# EAGLE schematic lightmeter_7 (EAGLE 9.6.2)
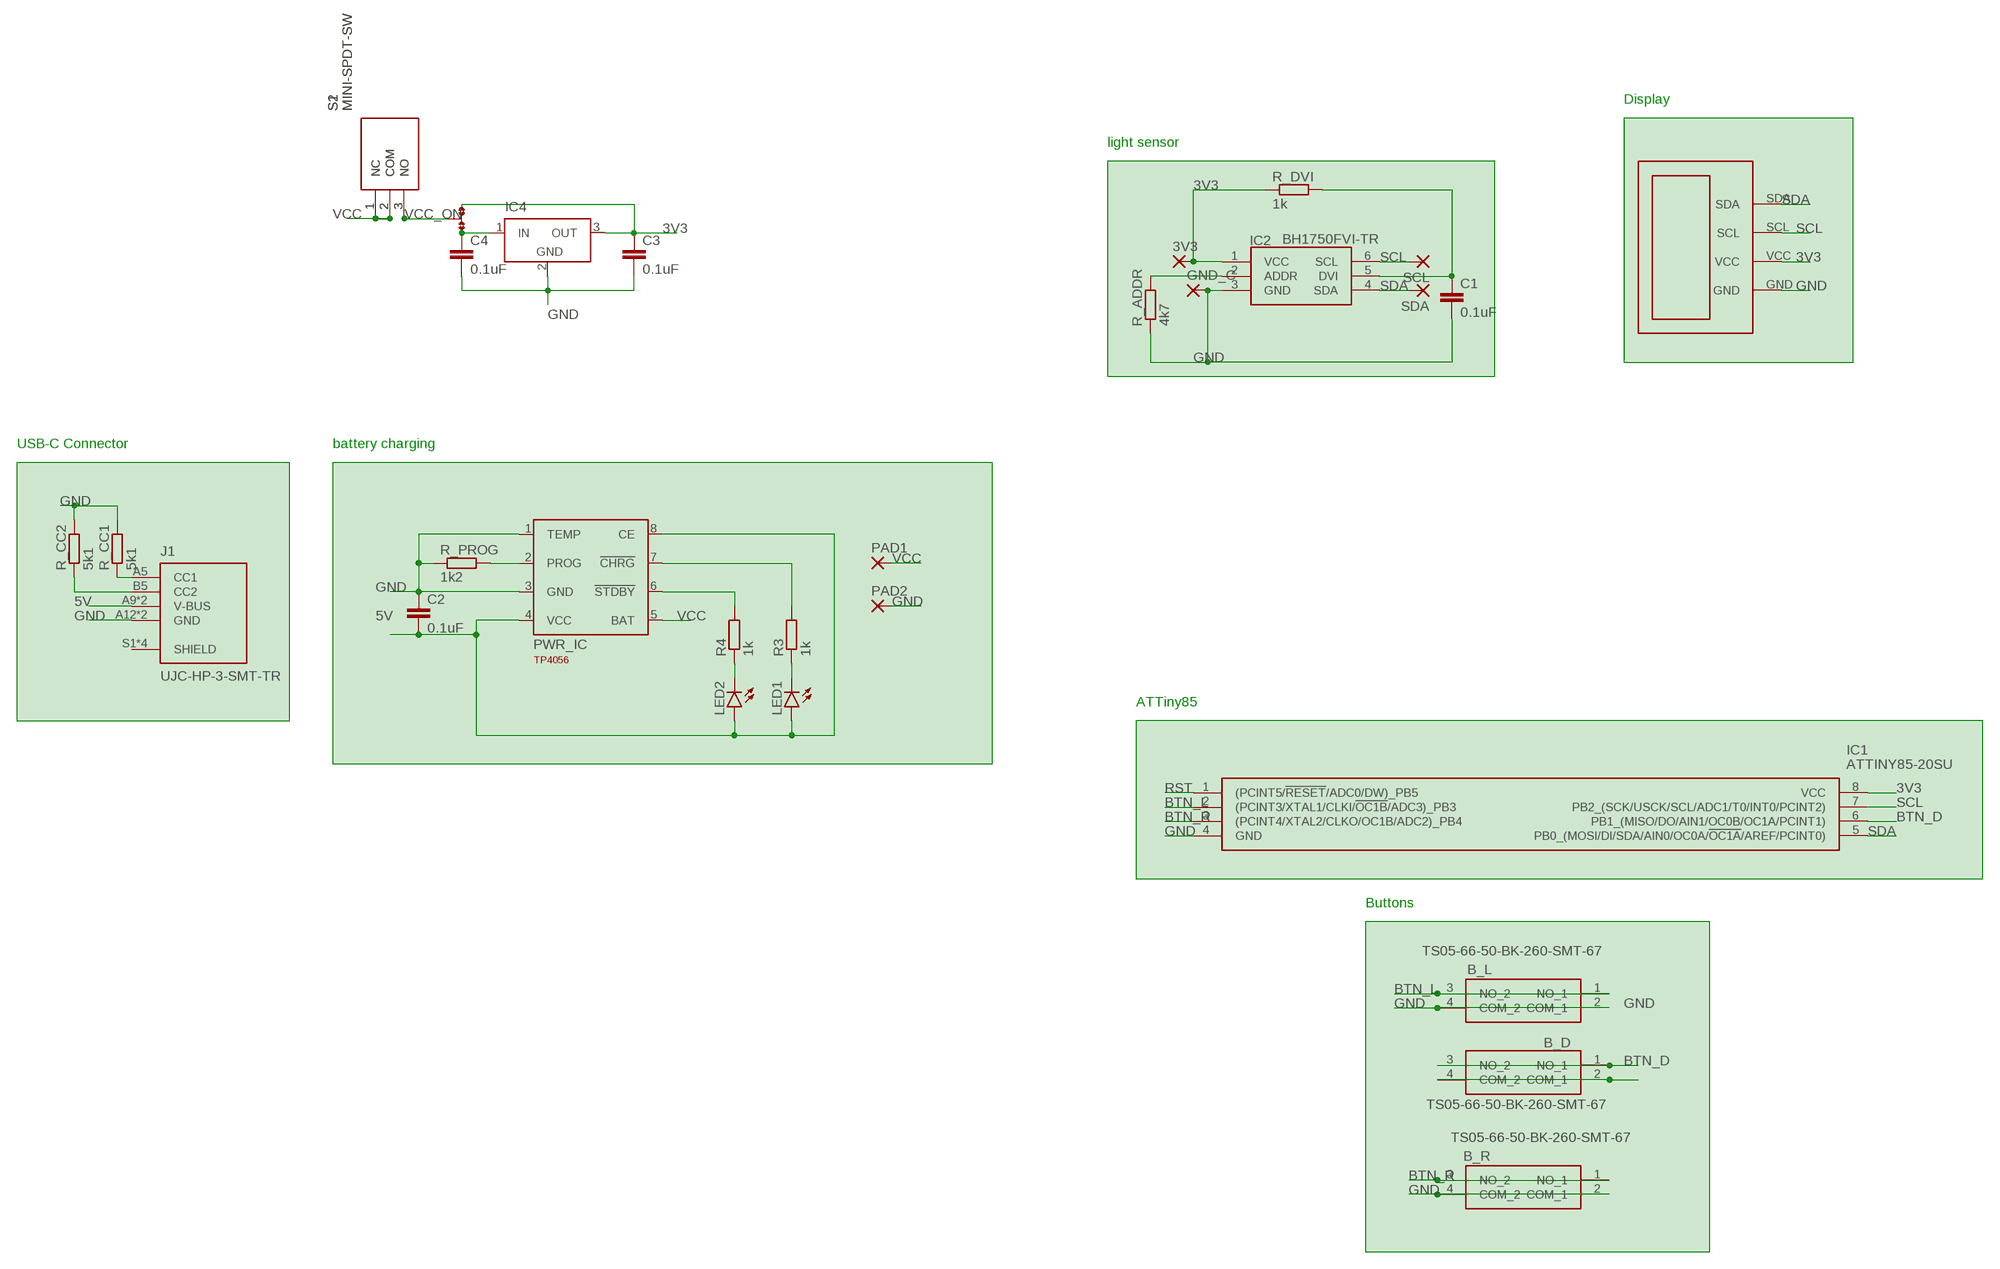
[diagram p0: schematic, sheet 1]

## Parts
3V3  1,6/0,8  [1,6/0,8]
B_D  TS05-66-50-BK-260-SMT-67  [TS056650BK260SMT67]
B_L  TS05-66-50-BK-260-SMT-67  [TS056650BK260SMT67]
B_R  TS05-66-50-BK-260-SMT-67  [TS056650BK260SMT67]
C1  0.1uF  C-EUC0805K  [C0805K]
C2  0.1uF  C-EUC0805K  [C0805K]
C3  0.1uF  C-EUC0805K  [C0805K]
C4  0.1uF  C-EUC0805K  [C0805K]
GND_C  1,6/0,8  [1,6/0,8]
IC1  ATTINY85-20SU  [SOIC127P798X216-8N]
IC2  BH1750FVI-TR  [WSOF6]
IC4  LT1129CST5  [SOT223]
J1  UJC-HP-3-SMT-TR  [CUI_UJC-HP-3-SMT-TR]
JMP1  0R-JUMPB  [B0R-JMP]
LED1  LEDCHIPLED_1206  [CHIPLED_1206]
LED2  LEDCHIPLED_1206  [CHIPLED_1206]
PAD1  2,54/0,9  [2,54/0,9]
PAD2  2,54/0,9  [2,54/0,9]
PWR_IC  TP4056  [SOT23-8]
R3  1k  R-EU_R0805  [R0805]
R4  1k  R-EU_R0805  [R0805]
R_ADDR  4k7  R-EU_R0805  [R0805]
R_CC1  5k1  R-EU_R0805  [R0805]
R_CC2  5k1  R-EU_R0805  [R0805]
R_DVI  1k  R-EU_R0805  [R0805]
R_PROG  1k2  R-EU_R0805  [R0805]
S1  MINI-SPDT-SW  [MINISPDTSW]
S2  MINI-SPDT-SW  [MINISPDTSW]
SCL  1,6/0,8  [1,6/0,8]
SDA  1,6/0,8  [1,6/0,8]
U$1  I2C_OLED_128X64  [I2C_OLED_128X64_BREAKOUT]

## Nets
3V3: 3V3.1(P) C3.1 IC1.8(VCC) IC2.1(VCC) IC4.3(OUT) JMP1.3 R_DVI.1 U$1.VCC
5V: C2.2 J1.A9(V-BUS) J1.B9(V-BUS) LED1.A LED2.A PWR_IC.4(VCC) PWR_IC.8(CE)
BTN_D: B_D.1(NO_1) B_D.3(NO_2) IC1.6(PB1_(MISO/DO/AIN1/OC0B/OC1A/PCINT1))
BTN_L: B_L.1(NO_1) B_L.3(NO_2) IC1.2((PCINT3/XTAL1/CLKI/!OC1B!/ADC3)_PB3)
BTN_R: B_R.1(NO_1) B_R.3(NO_2) IC1.3((PCINT4/XTAL2/CLKO/OC1B/ADC2)_PB4)
GND: B_D.2(COM_1) B_D.4(COM_2) B_L.2(COM_1) B_L.4(COM_2) B_R.2(COM_1) B_R.4(COM_2) C1.2 C2.1 C3.2 C4.2 GND_C.1(P) IC1.4(GND) IC2.3(GND) IC4.2(GND) J1.A12(GND) J1.B12(GND) PAD2.1(P) PWR_IC.1(TEMP) PWR_IC.3(GND) R_ADDR.1 R_CC1.2 R_CC2.2 R_PROG.1 U$1.GND
N$1: C1.1 IC2.5(DVI) R_DVI.2
N$2: IC2.2(ADDR) R_ADDR.2
N$3: J1.B5(CC2) R_CC2.1
N$4: PWR_IC.6(!STDBY) R4.2
N$5: PWR_IC.7(!CHRG) R3.2
N$6: LED2.C R4.1
N$7: LED1.C R3.1
N$8: J1.A5(CC1) R_CC1.1
N$9: PWR_IC.2(PROG) R_PROG.2
N$11: C4.1 IC4.1(IN) JMP1.1
RST: IC1.1((PCINT5/!RESET!/ADC0/DW)_PB5)
SCL: IC1.7(PB2_(SCK/USCK/SCL/ADC1/T0/INT0/PCINT2)) IC2.6(SCL) SCL.1(P) U$1.SCL
SDA: IC1.5(PB0_(MOSI/DI/SDA/AIN0/OC0A/!OC1A!/AREF/PCINT0)) IC2.4(SDA) SDA.1(P) U$1.SDA
VCC: PAD1.1(P) PWR_IC.5(BAT) S1.1(NC) S1.2(COM) S2.1(NC) S2.2(COM)
VCC_ON: JMP1.2 S1.3(NO) S2.3(NO)
Unconnected: J1.S1(SHIELD) J1.S2(SHIELD) J1.S3(SHIELD) J1.S4(SHIELD)

## Notes on the sheet
- Display
- light sensor
- USB-C Connector | battery charging
- ATTiny85
- Buttons

## Power pins joined to a net without a drawn wire
GND: IC4.4(GND)

## Library data of the parts
3V3 GND_C SCL SDA = wirepad:1,6/0,8: THROUGH-HOLE PAD
B_D B_L B_R = SamacSys_Parts:TS05-66-50-BK-260-SMT-67: Tactile Switches 6 x 6 mm, 5 mm Act Height, 260 gf, Black, Surface Mount, IP67, SPST, Source: Datasheet <https://www.cuidevices.com/product/resource/ts05.pdf>; DESCRIPTION: Tactile Switches 6 x 6 mm, 5 mm Act Height, 260 gf, Black, Surface Mount, IP67, SPST,; HEIGHT: 5.2mm; MANUFACTURER_NAME: CUI Inc.; MANUFACTURER_PART_NUMBER: TS05-66-50-BK-260-SMT-67; MOUSER_PART_NUMBER: 179-TS056650260SMT67; MOUSER_PRICE-STOCK: https://www.mouser.co.uk/ProductDetail/CUI-Devices/TS05-66-50-BK-260-SMT-67?qs=A6eO%252BMLsxmTTpMlvA87NHQ%3D%3D
C1-C4 = rcl:C-EU: CAPACITOR, European symbol; SPICEPREFIX: C
IC1 = SamacSys_Parts:ATTINY85-20SU: MICROCHIP - ATTINY85-20SU - MICROCONTROLLER MCU, 8 BIT, ATTINY, 20MHZ, SOIC-8 Source: Datasheet <https://componentsearchengine.com/Datasheets/2/ATTINY85-20SU.pdf>; DESCRIPTION: MICROCHIP - ATTINY85-20SU - MICROCONTROLLER MCU, 8 BIT, ATTINY, 20MHZ, SOIC-8; HEIGHT: 2.16mm; MANUFACTURER_NAME: Microchip; MANUFACTURER_PART_NUMBER: ATTINY85-20SU; MOUSER_PART_NUMBER: 556-ATTINY85-20SU; MOUSER_PRICE-STOCK: https://www.mouser.co.uk/ProductDetail/Microchip-Technology-Atmel/ATTINY85-20SU?qs=8jWQYweyg6N%2FGXnwAe4Icw%3D%3D
IC2 = SamacSys_Parts:BH1750FVI-TR: Ambient Light Sensor,16bit,I2C,WSOF6I ROHM BH1750FVI-TR Ambient Light Sensor Unit Surface Mount Source: Datasheet <https://componentsearchengine.com/Datasheets/2/BH1750FVI-TR.pdf>; DESCRIPTION: Ambient Light Sensor,16bit,I2C,WSOF6I ROHM BH1750FVI-TR Ambient Light Sensor Unit Surface Mount; HEIGHT: mm; MANUFACTURER_NAME: ROHM Semiconductor; MANUFACTURER_PART_NUMBER: BH1750FVI-TR; MOUSER_PART_NUMBER: 755-BH1750FVI-TR; MOUSER_PRICE-STOCK: https://www.mouser.co.uk/ProductDetail/ROHM-Semiconductor/BH1750FVI-TR?qs=phc6PQ%252BTPUNy88lRCs6mVA%3D%3D
IC4 = linear-technology:LT1129CST5: VOLTAGE REGULATOR with shutdown; MPN: LT1129CST-5#PBF; OC_FARNELL: 1663375; OC_NEWARK: 57M2069
J1 = UJC-HP-3-SMT-TR:UJC-HP-3-SMT-TR: Type C, 3 A, Right Angle, Surface Mount (SMT), Power-Only USB Receptacle Check availability <https://pricing.snapeda.com/parts/UJC-HP-3-SMT-TR/CUI%20Devices/view-part?ref=eda>; AVAILABILITY: In Stock; CUI_PURCHASE_URL: https://www.cuidevices.com/product/interconnect/connectors/usb-connectors/ujc-hp-3-smt-tr?utm_source=snapeda.com&utm_medium=referral&utm_campaign=snapedaBOM; DESCRIPTION: Type C, 3 A, Right Angle, Surface Mount (SMT), Power-Only USB Receptacle; MF: CUI Devices; MP: UJC-HP-3-SMT-TR; PACKAGE: None; PRICE: None; PURCHASE-URL: https://pricing.snapeda.com/search/part/UJC-HP-3-SMT-TR/?ref=eda
JMP1 = jump-0r-smd:0R-JUMP: SMD 0R 0805 Jumper
LED1 LED2 = led:LED: LED OSRAM: - CHIPLED LG R971, LG N971, LY N971, LG Q971, LY Q971, LO R971, LY R971 LH N974, LH R974 LS Q976, LO Q976, LY Q976 LO Q996 - Hyper CHIPLED LW Q18S LB Q993, LB Q99A, LB R99A - SideLED LS A670, LO A670, LY A670, LG A670, LP A670 LB A673, LV A673, LT A673, LW A673 LH A674 LY A675 LS A676, LA A676, LO A676, LY A676, LW A676 LS A679, LY A679, LG A679 - Hyper Micro SIDELED® LS Y876, LA Y876, LO Y876, LY Y876 LT Y87S - SmartLED LW L88C, LW L88S LB L89C, LB L89S, LG L890 LS L89K, LO L89K, LY L89K LS L896, LA L896, LO L896, LY L896 - TOPLED LS T670, LO T670, LY T670, LG T670, LP T670 LSG T670, LSP T670, LSY T670, LOP T670, LYG T670 LG T671, LOG T671, LSG T671 LB T673, LV T673, LT T673, LW T673 LH T674 LS T676, LA T676, LO T676, LY T676, LB T676, LH T676, LSB T676, LW T676 LB T67C, LV T67C, LT T67C, LS T67K, LO T67K, LY T67K, LW E67C LS E67B, LA E67B, LO E67B, LY E67B, LB E67C, LV E67C, LT E67C LW T67C LS T679, LY T679, LG T679 LS T770, LO T770, LY T770, LG T770, LP T770 LB T773, LV T773, LT T773, LW T773 LH T774 LS E675, LA E675, LY E675, LS T675 LS T776, LA T776, LO T776, LY T776, LB T776 LHGB T686 LT T68C, LB T68C - Hyper Mini TOPLED® LB M676 - Mini TOPLED Santana® LG M470 LS M47K, LO M47K, LY M47K Source: http://www.osram.convergy.de LUXEON: - LUMILED® LXK2-PW12-R00, LXK2-PW12-S00, LXK2-PW14-U00, LXK2-PW14-V00 LXK2-PM12-R00, LXK2-PM12-S00, LXK2-PM14-U00 LXK2-PE12-Q00, LXK2-PE12-R00, LXK2-PE12-S00, LXK2-PE14-T00, LXK2-PE14-U00 LXK2-PB12-K00, LXK2-PB12-L00, LXK2-PB12-M00, LXK2-PB14-N00, LXK2-PB14-P00, LXK2-PB14-Q00 LXK2-PR12-L00, LXK2-PR12-M00, LXK2-PR14-Q00, LXK2-PR14-R00 LXK2-PD12-Q00, LXK2-PD12-R00, LXK2-PD12-S00 LXK2-PH12-R00, LXK2-PH12-S00 LXK2-PL12-P00, LXK2-PL12-Q00, LXK2-PL12-R00 Source: www.luxeon.com KINGBRIGHT: KA-3528ASYC Source: www.kingbright.com
PAD1 PAD2 = wirepad:2,54/0,9: THROUGH-HOLE PAD
PWR_IC = tp4056:TP4056: TP4056 Data sheet <http://goo.gl/J7k8TF> Dave.Calaway Eagle Library <https://goo.gl/Muy1Tr>
R3 R4 R_ADDR R_CC1 R_CC2 R_DVI R_PROG = rcl:R-EU_: RESISTOR, European symbol; SPICEPREFIX: R
S1 S2 = SamacSys_Parts:MINI-SPDT-SW: Slide Switches MINI SPDT SWITCH Source: Datasheet <http://site.gravitech.us/Components/MINI-SPDT-SW/EG1218_datasheet.pdf>; DESCRIPTION: Slide Switches MINI SPDT SWITCH; HEIGHT: mm; MANUFACTURER_NAME: Gravitech; MANUFACTURER_PART_NUMBER: MINI-SPDT-SW; MOUSER_PART_NUMBER: 992-MINI-SPDT-SW; MOUSER_PRICE-STOCK: https://www.mouser.co.uk/ProductDetail/Gravitech/MINI-SPDT-SW?qs=Vxac6xGyzPm8ENq695r3yA%3D%3D
U$1 = my_breakouts:I2C_OLED_128X64